# Altium schematic sheet lab10.SCHDOC
size 420 x 297 mm; SheetNumber: 1; SheetTotal: 1; DocumentName: Sheet1.SCHDOC
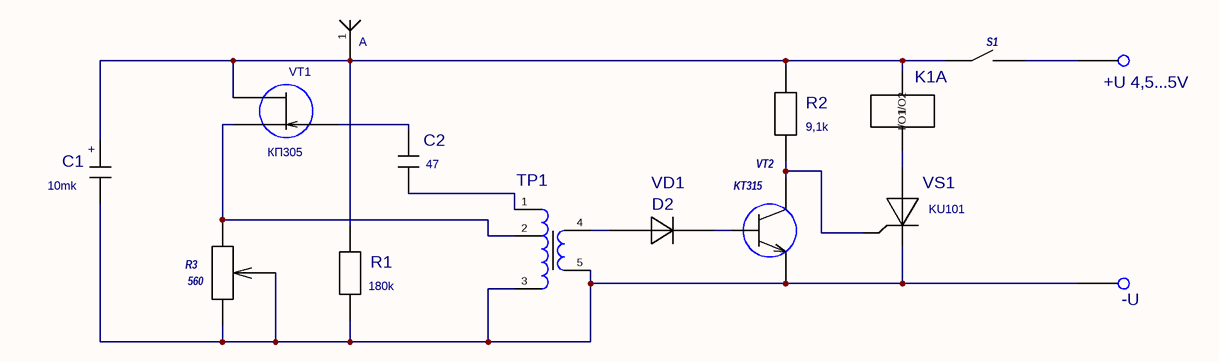
[diagram p0: lab10.SCHDOC]

## Parts
1  A  [A]
2  value +U 4,5...5V  [A]  (hidden comment: XT_1)
3  value -U  [A]  (hidden comment: XT_1)
C1  value 10mk  [CAP2]  (hidden comment: CAP2)
C2  value 47  [CAP1]  (hidden comment: CAP1)
K1  КУЦ1  [KUZ1]  (value not drawn)  (part A of 3)
R1  value 180k  [RES]  (hidden comment: RES)
R2  value 9,1k  [RES]  (hidden comment: RES)
R3  value 560  [СП3-38В]  (hidden comment: СП3-38В)
S1  T1  [Т1]  (value not drawn)
TP1  TRANSMORMATOR  [TRANSFORMATOR]  (value not drawn)
VD1  D2  [D2]
VS1  KU101  [KU101]
VT1  КП305  [КП305]
VT2  KT315  [КT315]

## Nets
Net1_1: 1.1 C1.1 K1.2(I/O2) R1.2 R2.2 S1.1 VT1.2
Net2_1: 2.1 S1.2
Net3_1: 3.1 C1.2 R1.1 R3.2 R3.3 TP1.3 TP1.5 VS1.2(I/OB) VT2.3
NetC2_1: C2.1 TP1.1
NetC2_2: C2.2 VT1.3
NetK1_1: K1.1(I/O1) VS1.1(I/OA)
NetR2_1: R2.1 VS1.3(IN) VT2.2
NetR3_1: R3.1 TP1.2 VT1.1
NetTP1_4: TP1.4 VD1.2(A)
NetVD1_1: VD1.1(K) VT2.1

## Notes on the sheet
- (in symbol CAP2) +

## Library data of the parts
1 = A: Value: *
K1 = КУЦ1: Value: *
TP1 = TRANSMORMATOR: Value: *
VS1 = KU101: Value: *
VT1 = КП305: Value: *